# EAGLE design bbps2 (EAGLE 5.11)
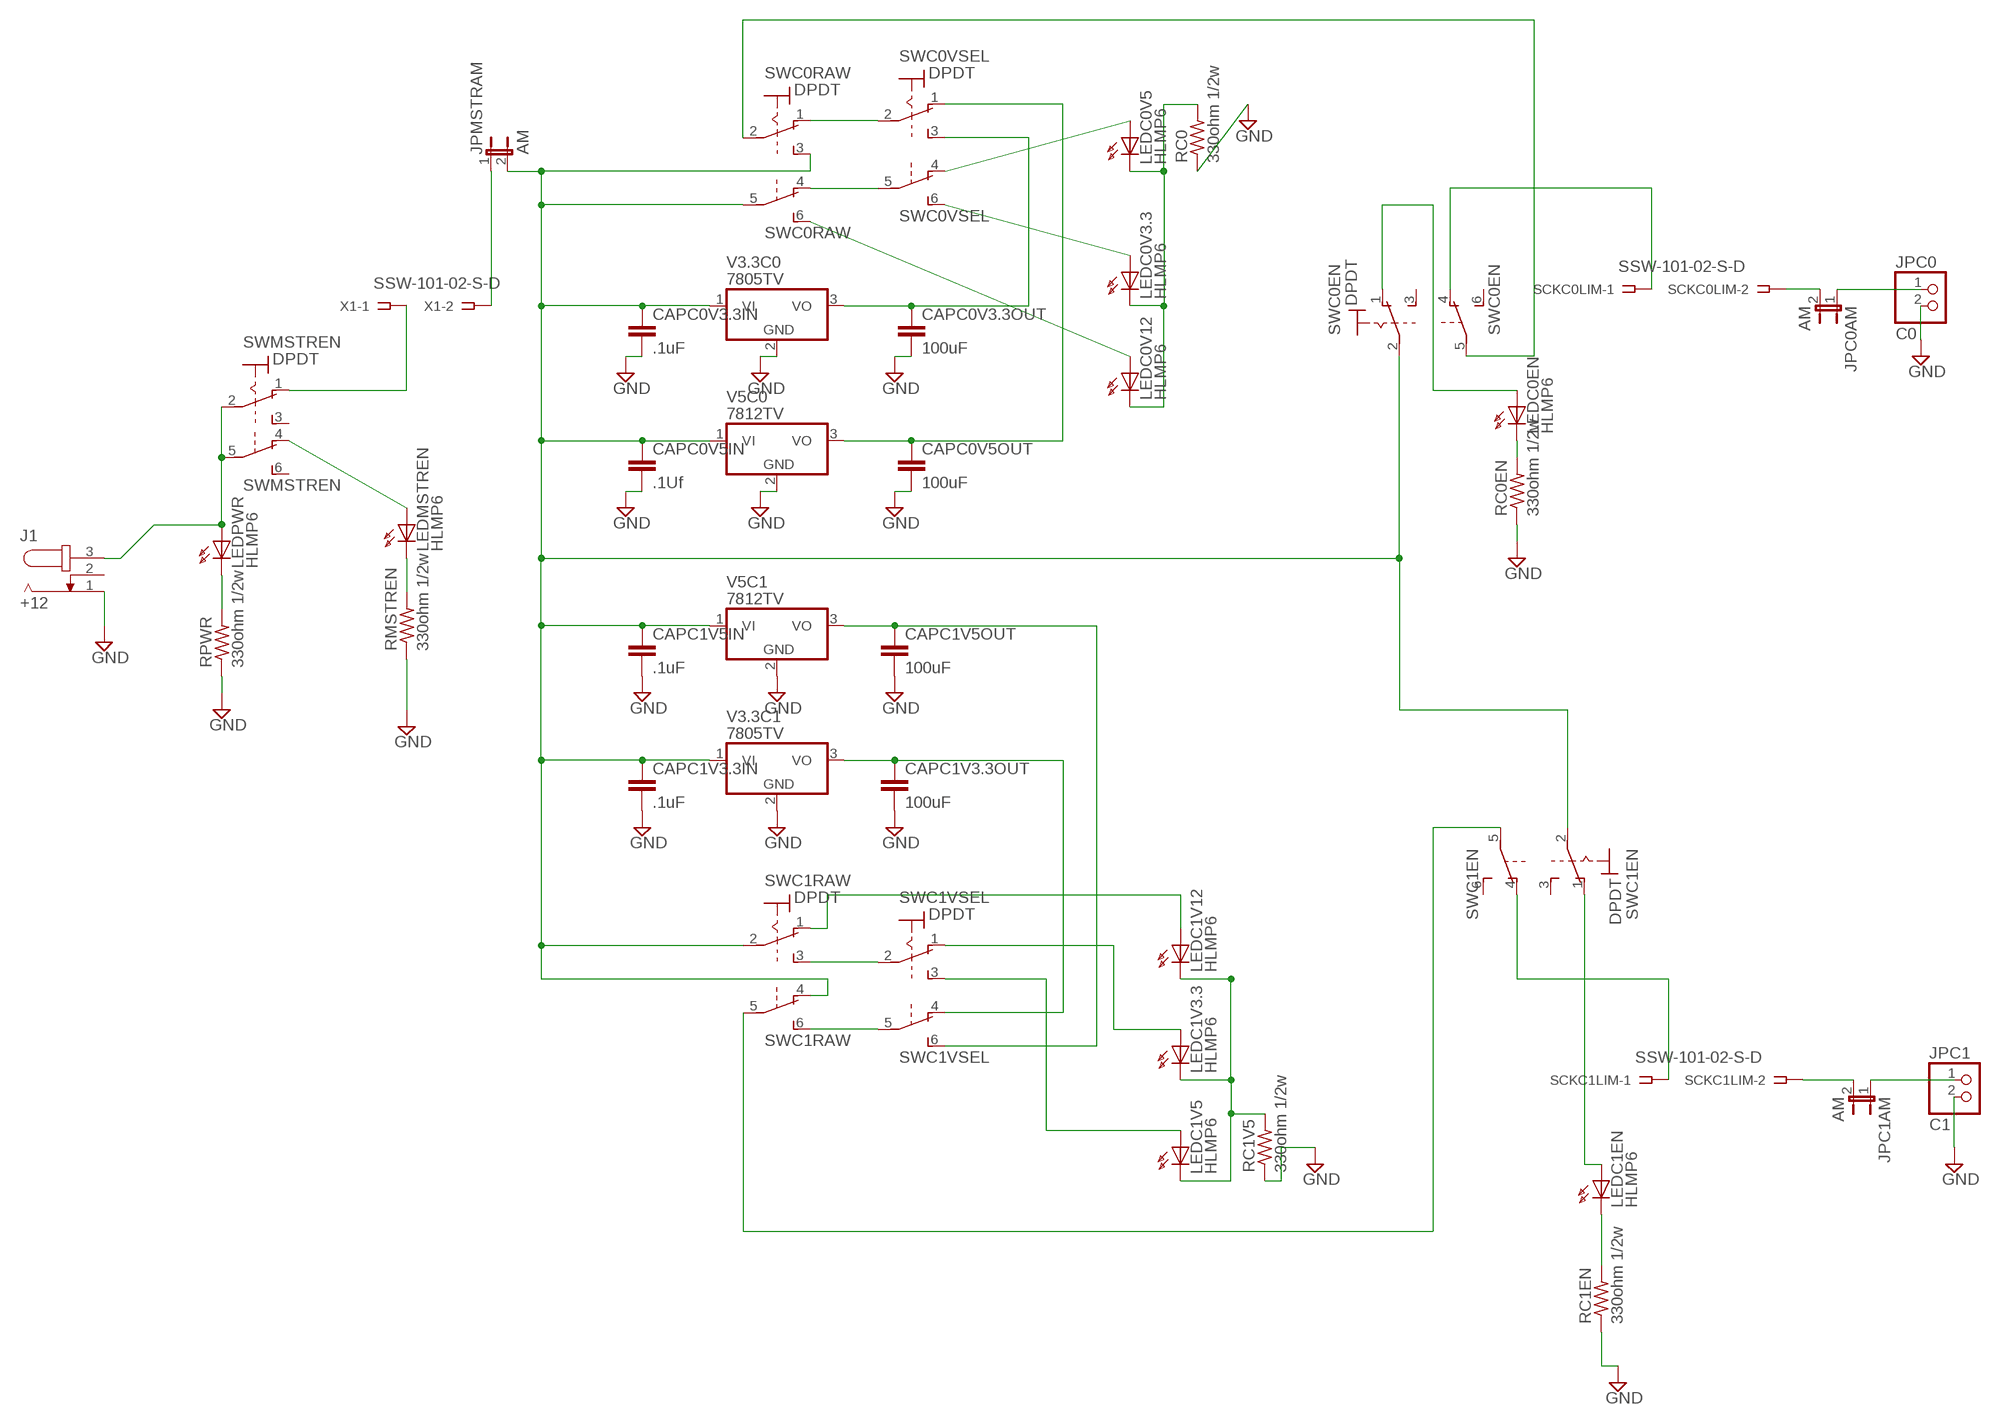
[diagram p0: schematic, sheet 1]

## Parts
CAPC0V3.3IN  .1uF  C5/7.2  [C5B7.2]
CAPC0V3.3OUT  100uF  C5/7.2  [C5B7.2]
CAPC0V5IN  .1Uf  C5/7.2  [C5B7.2]
CAPC0V5OUT  100uF  C5/7.2  [C5B7.2]
CAPC1V3.3IN  .1uF  C5/7.2  [C5B7.2]
CAPC1V3.3OUT  100uF  C5/7.2  [C5B7.2]
CAPC1V5IN  .1uF  C5/7.2  [C5B7.2]
CAPC1V5OUT  100uF  C5/7.2  [C5B7.2]
J1  +12  JACK-PLUG0  [SPC4077]
JPC0  C0  PINHD-1X2  [1X02]
JPC0AM  AM  JP1E  [JP1]
JPC1  C1  PINHD-1X2  [1X02]
JPC1AM  AM  JP1E  [JP1]
JPMSTRAM  AM  JP1E  [JP1]
LEDC0EN  HLMP6  [HLMP6]
LEDC0V3.3  HLMP6  [HLMP6]
LEDC0V5  HLMP6  [HLMP6]
LEDC0V12  HLMP6  [HLMP6]
LEDC1EN  HLMP6  [HLMP6]
LEDC1V3.3  HLMP6  [HLMP6]
LEDC1V5  HLMP6  [HLMP6]
LEDC1V12  HLMP6  [HLMP6]
LEDMSTREN  HLMP6  [HLMP6]
LEDPWR  HLMP6  [HLMP6]
RC0  330ohm 1/2w  R-US_0207/10  [0207/10]
RC0EN  330ohm 1/2w  R-US_0207/10  [0207/10]
RC1EN  330ohm 1/2w  R-US_0207/10  [0207/10]
RC1V5  330ohm 1/2w  R-US_0207/10  [0207/10]
RMSTREN  330ohm 1/2w  R-US_0207/10  [0207/10]
RPWR  330ohm 1/2w  R-US_0207/10  [0207/10]
SCKC0LIM  SSW-101-02-S-D  [SSW-101-02-S-D]
SCKC1LIM  SSW-101-02-S-D  [SSW-101-02-S-D]
SWC0EN  DPDT  320-938  [320-938]
SWC0RAW  DPDT  320-938  [320-938]
SWC0VSEL  DPDT  320-938  [320-938]
SWC1EN  DPDT  320-938  [320-938]
SWC1RAW  DPDT  320-938  [320-938]
SWC1VSEL  DPDT  320-938  [320-938]
SWMSTREN  DPDT  320-938  [320-938]
V3.3C0  7805TV  [TO220V]
V3.3C1  7805TV  [TO220V]
V5C0  7812TV  [TO220V]
V5C1  7812TV  [TO220V]
X1  SSW-101-02-S-D  [SSW-101-02-S-D]

## Nets
GND: CAPC0V3.3IN.2 CAPC0V3.3OUT.2 CAPC0V5IN.2 CAPC0V5OUT.2 CAPC1V3.3IN.2 CAPC1V3.3OUT.2 CAPC1V5IN.2 CAPC1V5OUT.2 J1.1 JPC0.2 JPC1.2 RC0.1 RC0EN.1 RC1EN.1 RC1V5.1 RMSTREN.1 RPWR.1 V3.3C0.2(GND) V3.3C1.2(GND) V5C0.2(GND) V5C1.2(GND)
N$1: J1.3 LEDPWR.A SWMSTREN.2(1:P) SWMSTREN.5(B:P)
N$2: LEDPWR.K RPWR.2
N$3: LEDMSTREN.A SWMSTREN.4(B:O)
N$4: LEDMSTREN.K RMSTREN.2
N$5: LEDC0V3.3.K LEDC0V5.K LEDC0V12.K RC0.2
N$6: JPMSTRAM.1 X1.2
N$8: JPC0.1 JPC0AM.1
N$9: CAPC1V3.3OUT.1 SWC1VSEL.4(B:O) V3.3C1.3(VO)
N$10: JPC0AM.2 SCKC0LIM.2
N$11: SCKC0LIM.1 SWC0EN.4(B:O)
N$12: LEDC0EN.A SWC0EN.1(1:O)
N$13: LEDC0EN.K RC0EN.2
N$17: SWC0EN.5(B:P) SWC0RAW.2(1:P)
N$18: CAPC1V5OUT.1 SWC1VSEL.6(B:S) V5C1.3(VO)
N$19: CAPC0V3.3IN.1 CAPC0V5IN.1 CAPC1V3.3IN.1 CAPC1V5IN.1 JPMSTRAM.2 SWC0EN.2(1:P) SWC0RAW.3(1:S) SWC0RAW.5(B:P) SWC1EN.2(1:P) SWC1RAW.2(1:P) SWC1RAW.4(B:O) V3.3C0.1(VI) V3.3C1.1(VI) V5C0.1(VI) V5C1.1(VI)
N$20: CAPC0V3.3OUT.1 SWC0VSEL.3(1:S) V3.3C0.3(VO)
N$21: CAPC0V5OUT.1 SWC0VSEL.1(1:O) V5C0.3(VO)
N$22: SWC0RAW.1(1:O) SWC0VSEL.2(1:P)
N$23: SWC0RAW.4(B:O) SWC0VSEL.5(B:P)
N$24: LEDC0V12.A SWC0RAW.6(B:S)
N$25: LEDC0V3.3.A SWC0VSEL.6(B:S)
N$26: LEDC0V5.A SWC0VSEL.4(B:O)
N$28: SWC1RAW.6(B:S) SWC1VSEL.5(B:P)
N$29: SWC1RAW.3(1:S) SWC1VSEL.2(1:P)
N$32: LEDC1V3.3.A SWC1VSEL.1(1:O)
N$33: LEDC1V3.3.K LEDC1V5.K LEDC1V12.K RC1V5.2
N$34: LEDC1V5.A SWC1VSEL.3(1:S)
N$36: LEDC1EN.A SWC1EN.1(1:O)
N$37: LEDC1EN.K RC1EN.2
N$38: SCKC1LIM.1 SWC1EN.4(B:O)
N$39: JPC1AM.2 SCKC1LIM.2
N$40: JPC1.1 JPC1AM.1
N$41: SWC1EN.5(B:P) SWC1RAW.5(B:P)
SCKMSTRLIM: SWMSTREN.1(1:O) X1.1
SWC1VSEL: LEDC1V12.A SWC1RAW.1(1:O)
Unconnected: J1.2 SWC0EN.3(1:S) SWC0EN.6(B:S) SWC1EN.3(1:S) SWC1EN.6(B:S) SWMSTREN.3(1:S) SWMSTREN.6(B:S)

## Library data of the parts
CAPC0V3.3IN CAPC0V3.3OUT CAPC0V5IN CAPC0V5OUT CAPC1V3.3IN CAPC1V3.3OUT CAPC1V5IN CAPC1V5OUT = capacitor-wima:C: CAPACITOR naming: grid - package width
J1 = con-jack:JACK-PLUG: DC POWER JACK Power Jack, DC, Right Angle, Through Hole, Rated 5A at 16VDC, PC Terminals Distributor: Farnell (www.Farnell.de) Drawing: 84N1161.pdf / 84N1162.pdf Manufacturer: SPC Technology (www.spctechnology.com) Type: SPC4077 / SPC 4078; OC_FARNELL: unknown; OC_NEWARK: unknown
JPC0 JPC1 = pinhead:PINHD-1X2: PIN HEADER
JPC0AM JPC1AM JPMSTRAM = jumper:JP1E: JUMPER
LEDC0EN LEDC0V3.3 LEDC0V5 LEDC0V12 LEDC1EN LEDC1V3.3 LEDC1V5 LEDC1V12 LEDMSTREN LEDPWR = display-hp:HLMP6: LED 2mm horizontal; MF: AGILENT TECHNOLOGIES; MPN: HLMP-6500; OC_FARNELL: 1652490; OC_NEWARK: 40K0088
RC0 RC0EN RC1EN RC1V5 RMSTREN RPWR = resistor:R-US_: RESISTOR, American symbol
SCKC0LIM SCKC1LIM X1 = con-samtec:SSW-101-02-S-D: THROUGH-HOLE .025" SQ POST SOCKET Source: Samtec SSW.pdf; MPN: SSW-101-02-S-D; OC_FARNELL: unknown; OC_NEWARK: 82P1456
SWC0EN SWC0RAW SWC0VSEL SWC1EN SWC1RAW SWC1VSEL SWMSTREN = switch:320-938: TOGGLE SWITCH distributor RS Components
V3.3C0 V3.3C1 V5C0 V5C1 = linear:78*: Positive VOLTAGE REGULATOR Source: http://cache.national.com/ds/LM/LM78L05.pdf http://www.fairchildsemi.com/ds/LM/LM7805.pdf

## Board
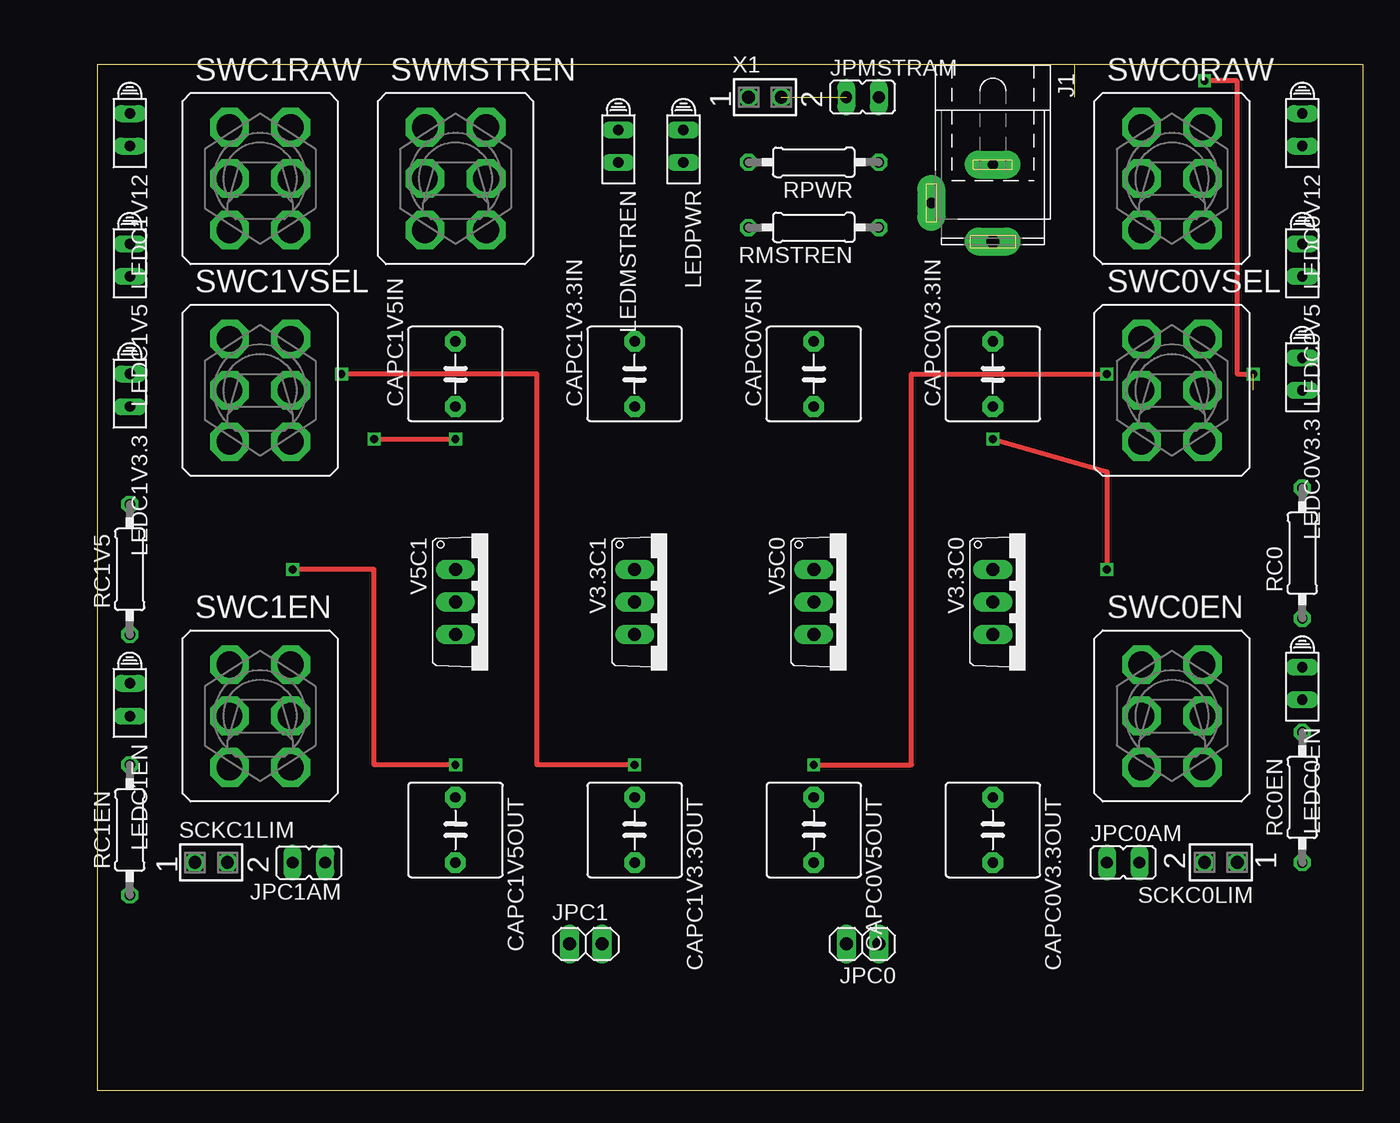
[diagram p1: board, top side]
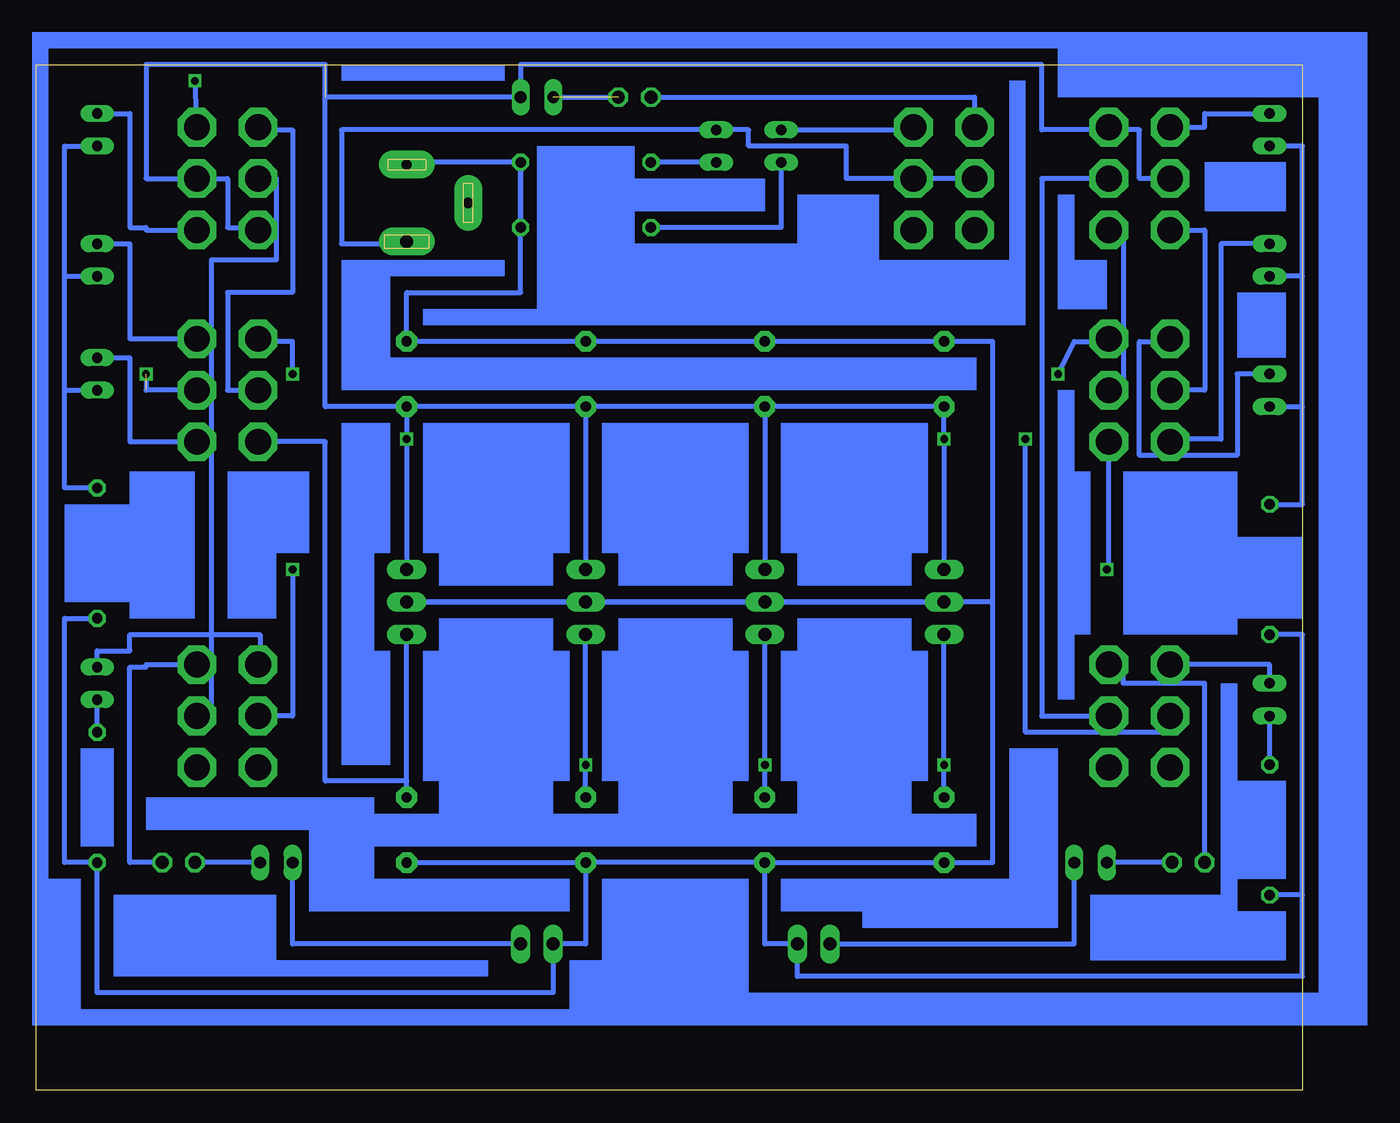
[diagram p2: board, bottom side, seen from below]

Size 98.73 x 80 mm. Coordinates in mm from the lower left corner, seen from the top.
Outline: 0,0 98.73,0 98.73,80 0,80 0,0
Copper layers (1*16): Top 0.035mm / dielectric 1.5mm / Bottom 0.035mm
Design rules "default": minimum track width 10mil, minimum drill 24mil, track to track 8mil, track to pad 8mil, pad to pad 8mil, via to via 8mil, smd to smd 8mil, copper to edge 40mil, drill to drill 8mil, minimum pad ring 10mil, minimum via ring 8mil, stop-mask expansion 4mil, vias tented up to drill 0mil, thermal gap 10mil

### Footprints (pad centres in the part's own frame; a part is rotated, then mirrored left to right if it is on the bottom)
C5B7.2 = drill 0.813 pad 1.6 octagon: 1 -2.54,0; 2 2.54,0
SPC4077 = drill 0.8 pad 2.184 long: 1 -3,0; 2 0,-4.8 | drill 1 pad 2.184 long: 3 3,0
1X02 = drill 1.016 long: 1 -1.27,0; 2 1.27,0
JP1 = drill 0.914 long: 1 0,-1.27; 2 0,1.27
HLMP6 = drill 0.813 long: A -1.27,0; K 1.27,0
0207/10 = drill 0.813 octagon: 1 -5.08,0; 2 5.08,0
SSW-101-02-S-D = drill 1 pad 1.5 octagon: 1 0,-1.27; 2 0,1.27
320-938 = drill 2.007 octagon: 1 -2.388,4.013; 2 -2.388,0; 3 -2.388,-4.013; 4 2.388,4.013; 5 2.388,0; 6 2.388,-4.013
TO220V = drill 1.016 long: 1 -2.54,-2.54; 2 0,-2.54; 3 2.54,-2.54

### Placement (x,y rotation side)
CAPC0V3.3IN  69.85,55.88 90 top
CAPC0V3.3OUT  69.85,20.32 270 top
CAPC0V5IN  55.88,55.88 90 top
CAPC0V5OUT  55.88,20.32 270 top
CAPC1V3.3IN  41.91,55.88 90 top
CAPC1V3.3OUT  41.91,20.32 270 top
CAPC1V5IN  27.94,55.88 90 top
CAPC1V5OUT  27.94,20.32 270 top
J1  69.85,69.22 270 top
JPC0  59.69,11.43 180 top
JPC0AM  80.01,17.78 270 top
JPC1  38.1,11.43 0 top
JPC1AM  16.51,17.78 90 top
JPMSTRAM  59.69,77.47 270 top
LEDC0EN  93.98,31.75 270 top
LEDC0V3.3  93.98,55.88 270 top
LEDC0V5  93.98,64.77 270 top
LEDC0V12  93.98,74.93 270 top
LEDC1EN  2.54,30.48 270 top
LEDC1V3.3  2.54,54.61 270 top
LEDC1V5  2.54,64.77 270 top
LEDC1V12  2.54,74.93 270 top
LEDMSTREN  40.64,73.66 270 top
LEDPWR  45.72,73.66 270 top
RC0  93.98,41.91 90 top
RC0EN  93.98,22.86 90 top
RC1EN  2.54,20.32 90 top
RC1V5  2.54,40.64 90 top
RMSTREN  55.88,67.31 180 top
RPWR  55.88,72.39 180 top
SCKC0LIM  87.63,17.78 90 top
SCKC1LIM  8.89,17.78 270 top
SWC0EN  83.82,29.21 0 top
SWC0RAW  83.82,71.12 0 top
SWC0VSEL  83.82,54.61 0 top
SWC1EN  12.7,29.21 0 top
SWC1RAW  12.7,71.12 0 top
SWC1VSEL  12.7,54.61 0 top
SWMSTREN  27.94,71.12 0 top
V3.3C0  72.39,38.1 270 top
V3.3C1  44.45,38.1 270 top
V5C0  58.42,38.1 270 top
V5C1  30.48,38.1 270 top
X1  52.07,77.47 270 top

### Tracks (layer width: path | path; a pad name or v marks a point on that pad's centre or on a via)
GND
  Bottom 0.406: RPWR.1 60.96,62.23 69.85,62.23 CAPC0V3.3IN.2 CAPC0V5IN.2 CAPC1V3.3IN.2 CAPC1V5IN.2 24.13,58.42 24.13,38.1 | V5C1.2 V3.3C1.2 V5C0.2 V3.3C0.2 24.13,38.1 | 24.13,38.1 24.13,17.78 CAPC1V5OUT.2 CAPC1V3.3OUT.2 | CAPC1V3.3OUT.2 CAPC0V5OUT.2 | CAPC1V3.3OUT.2 41.91,11.43 JPC1.2 39.37,8.89 0,8.89 0,15.24 | RPWR.1 RMSTREN.1 | RPWR.1 69.85,72.39 J1.1 | CAPC0V3.3OUT.2 CAPC0V5OUT.2 | CAPC0V5OUT.2 55.88,11.43 JPC0.2 58.42,7.62 93.98,7.62 RC0EN.1 96.52,17.78 96.52,36.83 RC0.1 | 0,15.24 RC1EN.1 | RC1V5.1 0,35.56 0,15.24
N$1
  Bottom 0.406: J1.3 69.85,66.04 74.93,66.04 74.93,74.93 LEDPWR.A 43.18,74.93 43.18,73.66 35.56,73.66 35.56,71.12 SWMSTREN.5 SWMSTREN.2
N$2
  Bottom 0.406: LEDPWR.K RPWR.2
N$3
  Bottom 0.406: LEDMSTREN.A 30.33,74.93 SWMSTREN.4
N$4
  Bottom 0.406: LEDMSTREN.K 40.64,67.31 RMSTREN.2
N$5
  Bottom 0.406: LEDC0V12.K 96.52,73.66 96.52,63.5 | 96.52,63.5 LEDC0V5.K | 96.52,54.61 LEDC0V3.3.K | 96.52,54.61 96.52,63.5 | RC0.2 96.52,46.99 96.52,54.61
N$6  (1 unrouted)
  Bottom 0.406: JPMSTRAM.1 X1.2
N$7  (via drill 0.6)
  other vias: 90.17,55.88
N$8
  Bottom 0.406: JPC0.1 78.74,11.43 JPC0AM.1
N$9  (via drill 0.6)
  Top 0.406: v19.05,55.88 34.29,55.88 34.29,25.4 v41.91,25.4
  Bottom 0.406: CAPC1V3.3OUT.1 v41.91,25.4 V3.3C1.3 | SWC1VSEL.4 15.09,58.42 17.78,58.42 v19.05,55.88
N$10
  Bottom 0.406: JPC0AM.2 SCKC0LIM.2
N$11
  Bottom 0.406: SCKC0LIM.1 91.44,17.78 91.44,33.02 90.17,33.02 90.17,33.22 SWC0EN.4
N$12
  Bottom 0.406: LEDC0EN.A 93.98,34.29 91.44,34.29 91.44,35.56 81.28,35.56 81.28,33.22 SWC0EN.1
N$13
  Bottom 0.406: RC0EN.2 LEDC0EN.K
N$17
  Bottom 0.406: SWC0RAW.2 80.01,71.12 80.01,64.77 85.09,64.77 85.09,29.21 SWC0EN.5
N$18  (via drill 0.6)
  Top 0.406: v15.24,40.64 21.59,40.64 21.59,25.4 v27.94,25.4
  Bottom 0.406: CAPC1V5OUT.1 v27.94,25.4 V5C1.3 | SWC1VSEL.6 15.09,40.64 v15.24,40.64
N$19  (via drill 0.6)  (1 unrouted)
  Top 0.406: v78.74,40.64 78.74,48.26 v69.85,50.8 | v21.59,50.8 v27.94,50.8
  Bottom 0.406: V5C1.1 v27.94,50.8 CAPC1V5IN.1 CAPC1V3.3IN.1 | CAPC1V3.3IN.1 V3.3C1.1 | CAPC0V3.3IN.1 v69.85,50.8 V3.3C0.1 CAPC0V3.3IN.1 | CAPC1V3.3IN.1 CAPC0V5IN.1 | CAPC0V5IN.1 V5C0.1 | CAPC0V3.3IN.1 76.2,53.34 76.2,80.01 90.17,80.01 90.17,71.12 SWC0RAW.5 83.82,71.12 83.82,67.31 81.43,67.31 SWC0RAW.3 | 76.2,77.47 JPMSTRAM.2 60.96,80.01 20.32,80.01 20.32,74.93 15.09,74.93 | SWC1RAW.2 12.7,71.12 12.7,74.93 15.09,74.93 | 15.09,74.93 SWC1RAW.4 | SWC1EN.2 10.31,27.94 21.59,27.94 v21.59,50.8 | SWC0EN.2 78.74,29.21 v78.74,40.64 | CAPC0V5IN.1 CAPC0V3.3IN.1
N$20
  Bottom 0.406: V3.3C0.3 CAPC0V3.3OUT.1 69.85,24.13 76.2,24.13 76.2,50.6 SWC0VSEL.3
N$21  (via drill 0.6)
  Top 0.406: v78.74,55.88 63.5,55.88 63.5,25.4 v55.88,25.4
  Bottom 0.406: CAPC0V5OUT.1 v55.88,25.4 V5C0.3 | SWC0VSEL.1 81.43,58.42 78.74,58.42 v78.74,55.88
N$22
  Bottom 0.406: SWC0RAW.1 81.43,74.93 78.74,74.93 78.74,62.23 83.82,62.23 83.82,54.61 SWC0VSEL.2
N$23  (via drill 0.6)  (1 unrouted)
  Top 0.406: v86.36,78.74 88.9,78.74 88.9,55.88 90.17,55.88
  Bottom 0.406: SWC0RAW.4 86.21,74.93 v86.36,78.74 | SWC0VSEL.5 90.17,54.61 90.17,55.88
N$24
  Bottom 0.406: LEDC0V12.A 91.44,76.2 91.44,67.31 90.17,67.31 90.17,67.11 SWC0RAW.6
N$25
  Bottom 0.406: LEDC0V3.3.A 91.44,57.15 91.44,50.6 SWC0VSEL.6
N$26
  Bottom 0.406: LEDC0V5.A 91.44,66.04 91.44,58.62 SWC0VSEL.4
N$28
  Bottom 0.406: SWC1RAW.6 15.09,67.31 13.97,67.31 13.97,54.61 SWC1VSEL.5
N$29
  Bottom 0.406: SWC1RAW.3 7.62,67.11 7.62,54.61 SWC1VSEL.2
N$32
  Bottom 0.406: LEDC1V3.3.A 5.08,55.88 5.08,49.53 12.7,49.53 12.7,58.42 10.31,58.42 SWC1VSEL.1
N$33
  Bottom 0.406: LEDC1V12.K 0,73.66 0,63.5 | 0,53.34 0,45.72 RC1V5.2 | LEDC1V3.3.K 0,53.34 | 0,53.34 0,63.5 | 0,63.5 LEDC1V5.K
N$34
  Bottom 0.406: LEDC1V5.A 6.35,66.04 6.35,50.8 10.31,50.8 SWC1VSEL.3
N$36
  Bottom 0.406: LEDC1EN.A 2.54,33.22 SWC1EN.1
N$37
  Bottom 0.406: RC1EN.2 LEDC1EN.K
N$38
  Bottom 0.406: SCKC1LIM.1 7.62,31.75 13.97,31.75 13.97,33.22 SWC1EN.4
N$39
  Bottom 0.406: SCKC1LIM.2 JPC1AM.2
N$40
  Bottom 0.406: JPC1.1 17.78,11.43 JPC1AM.1
N$41
  Bottom 0.406: SWC1RAW.5 20.32,71.12 20.32,29.21 SWC1EN.5
SCKMSTRLIM
  Bottom 0.406: X1.1 25.55,77.47 SWMSTREN.1
SWC1VSEL
  Bottom 0.406: SWC1RAW.1 7.62,75.13 7.62,76.2 LEDC1V12.A
(copper drawn outside any net)
  shapes: Bottom area x74